# Altium schematic sheet L6790A_Si.SchDoc: LG L6790A Single Stage PFC LLC
size 594 x 420 mm; Author: Frank KWON; CompanyName: STMicroelectronics; DrawnBy: Frank KWON; Engineer: Frank KWON; Organization: AM&S APeC Korea; SheetNumber: 2; SheetTotal: 2
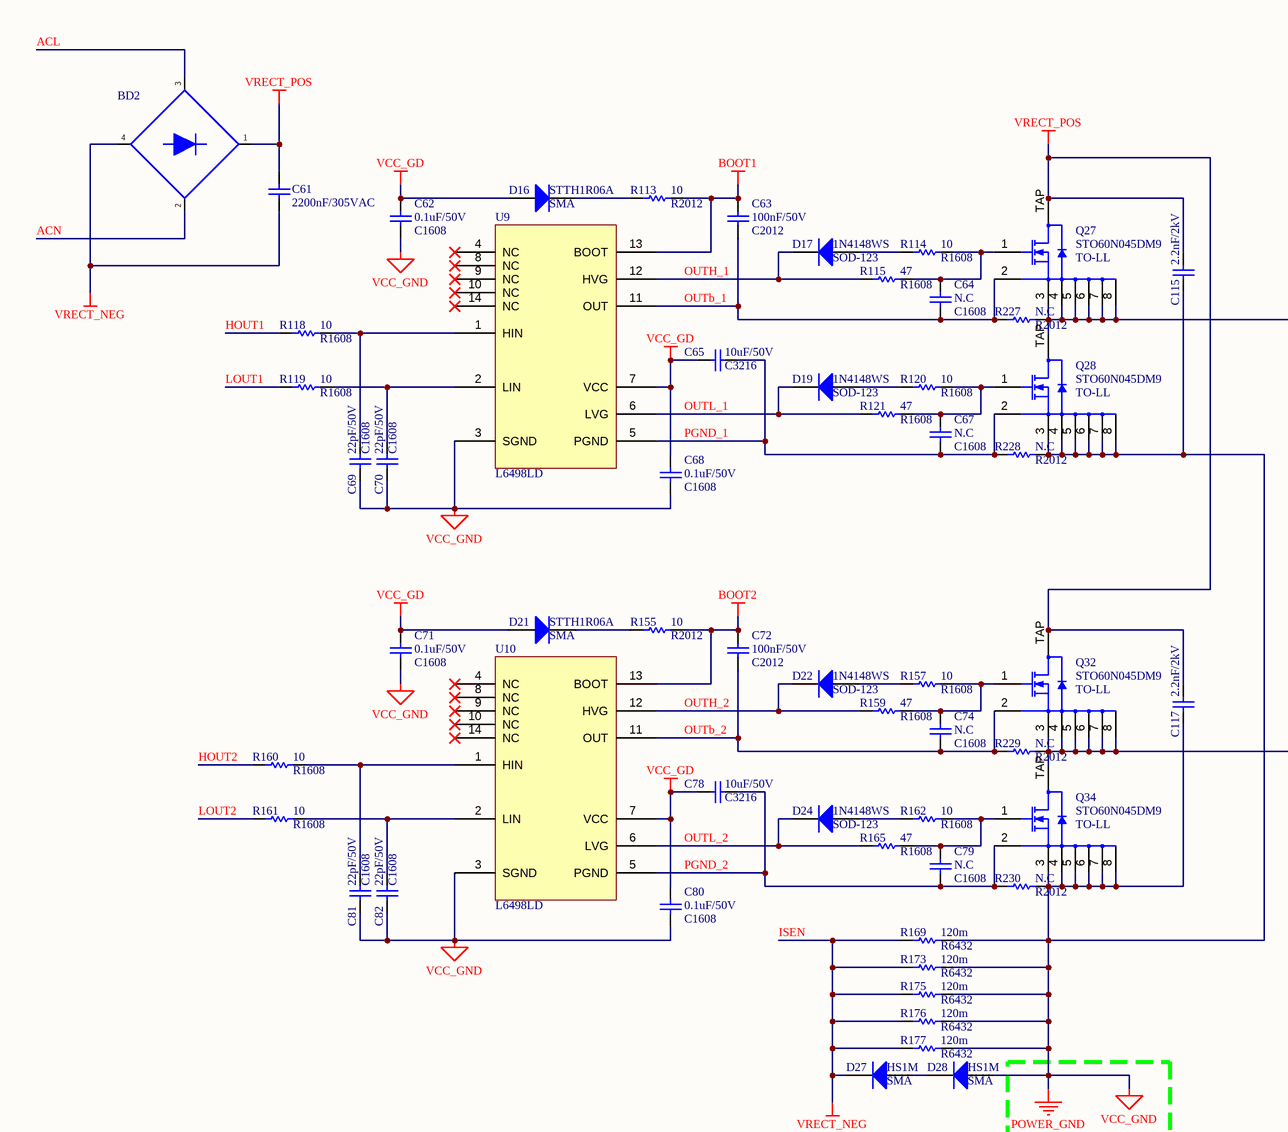
[diagram p0: L6790A_Si.SchDoc, top left]
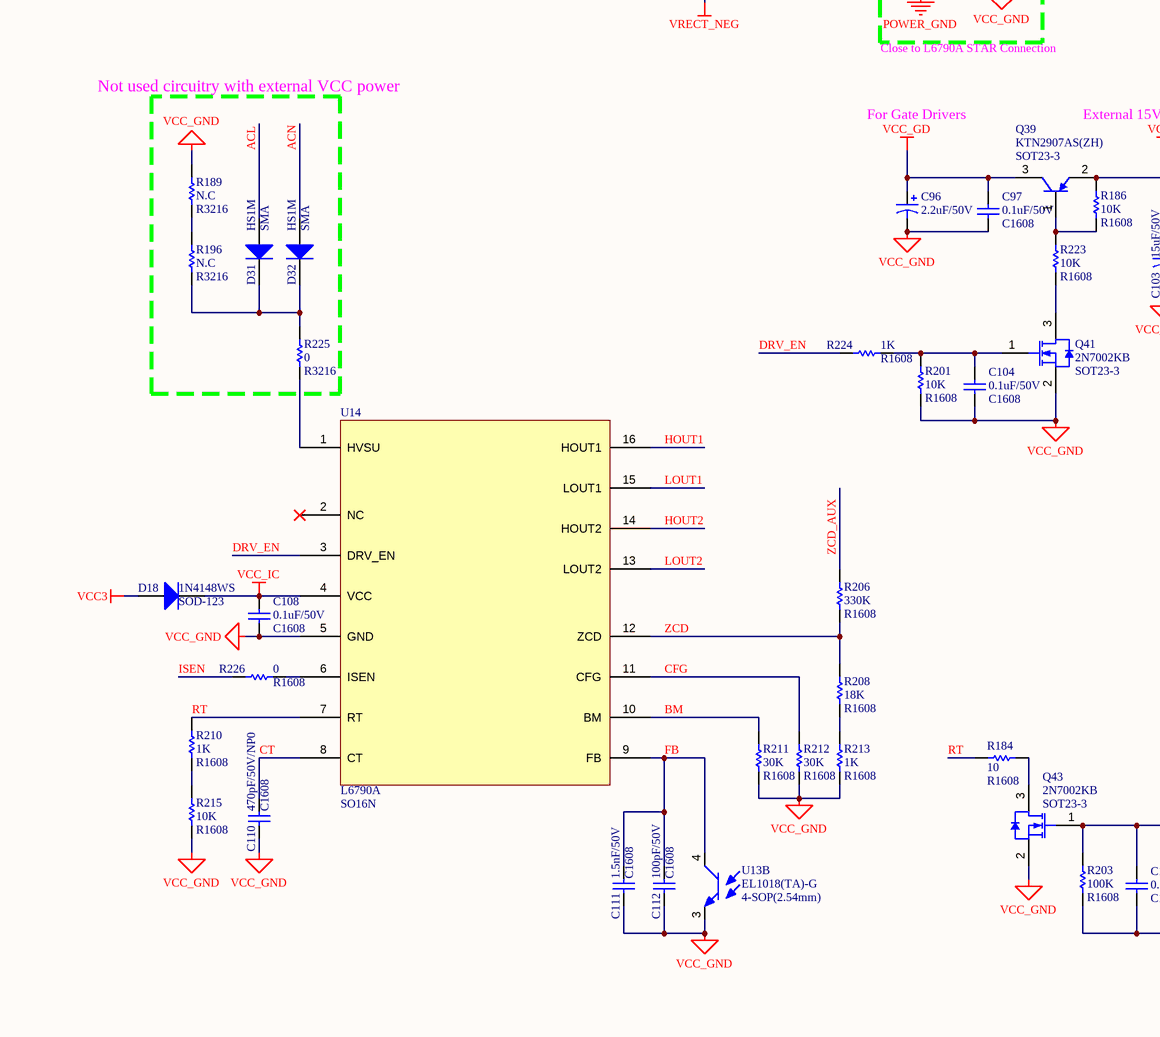
[diagram p1: L6790A_Si.SchDoc, bottom left]
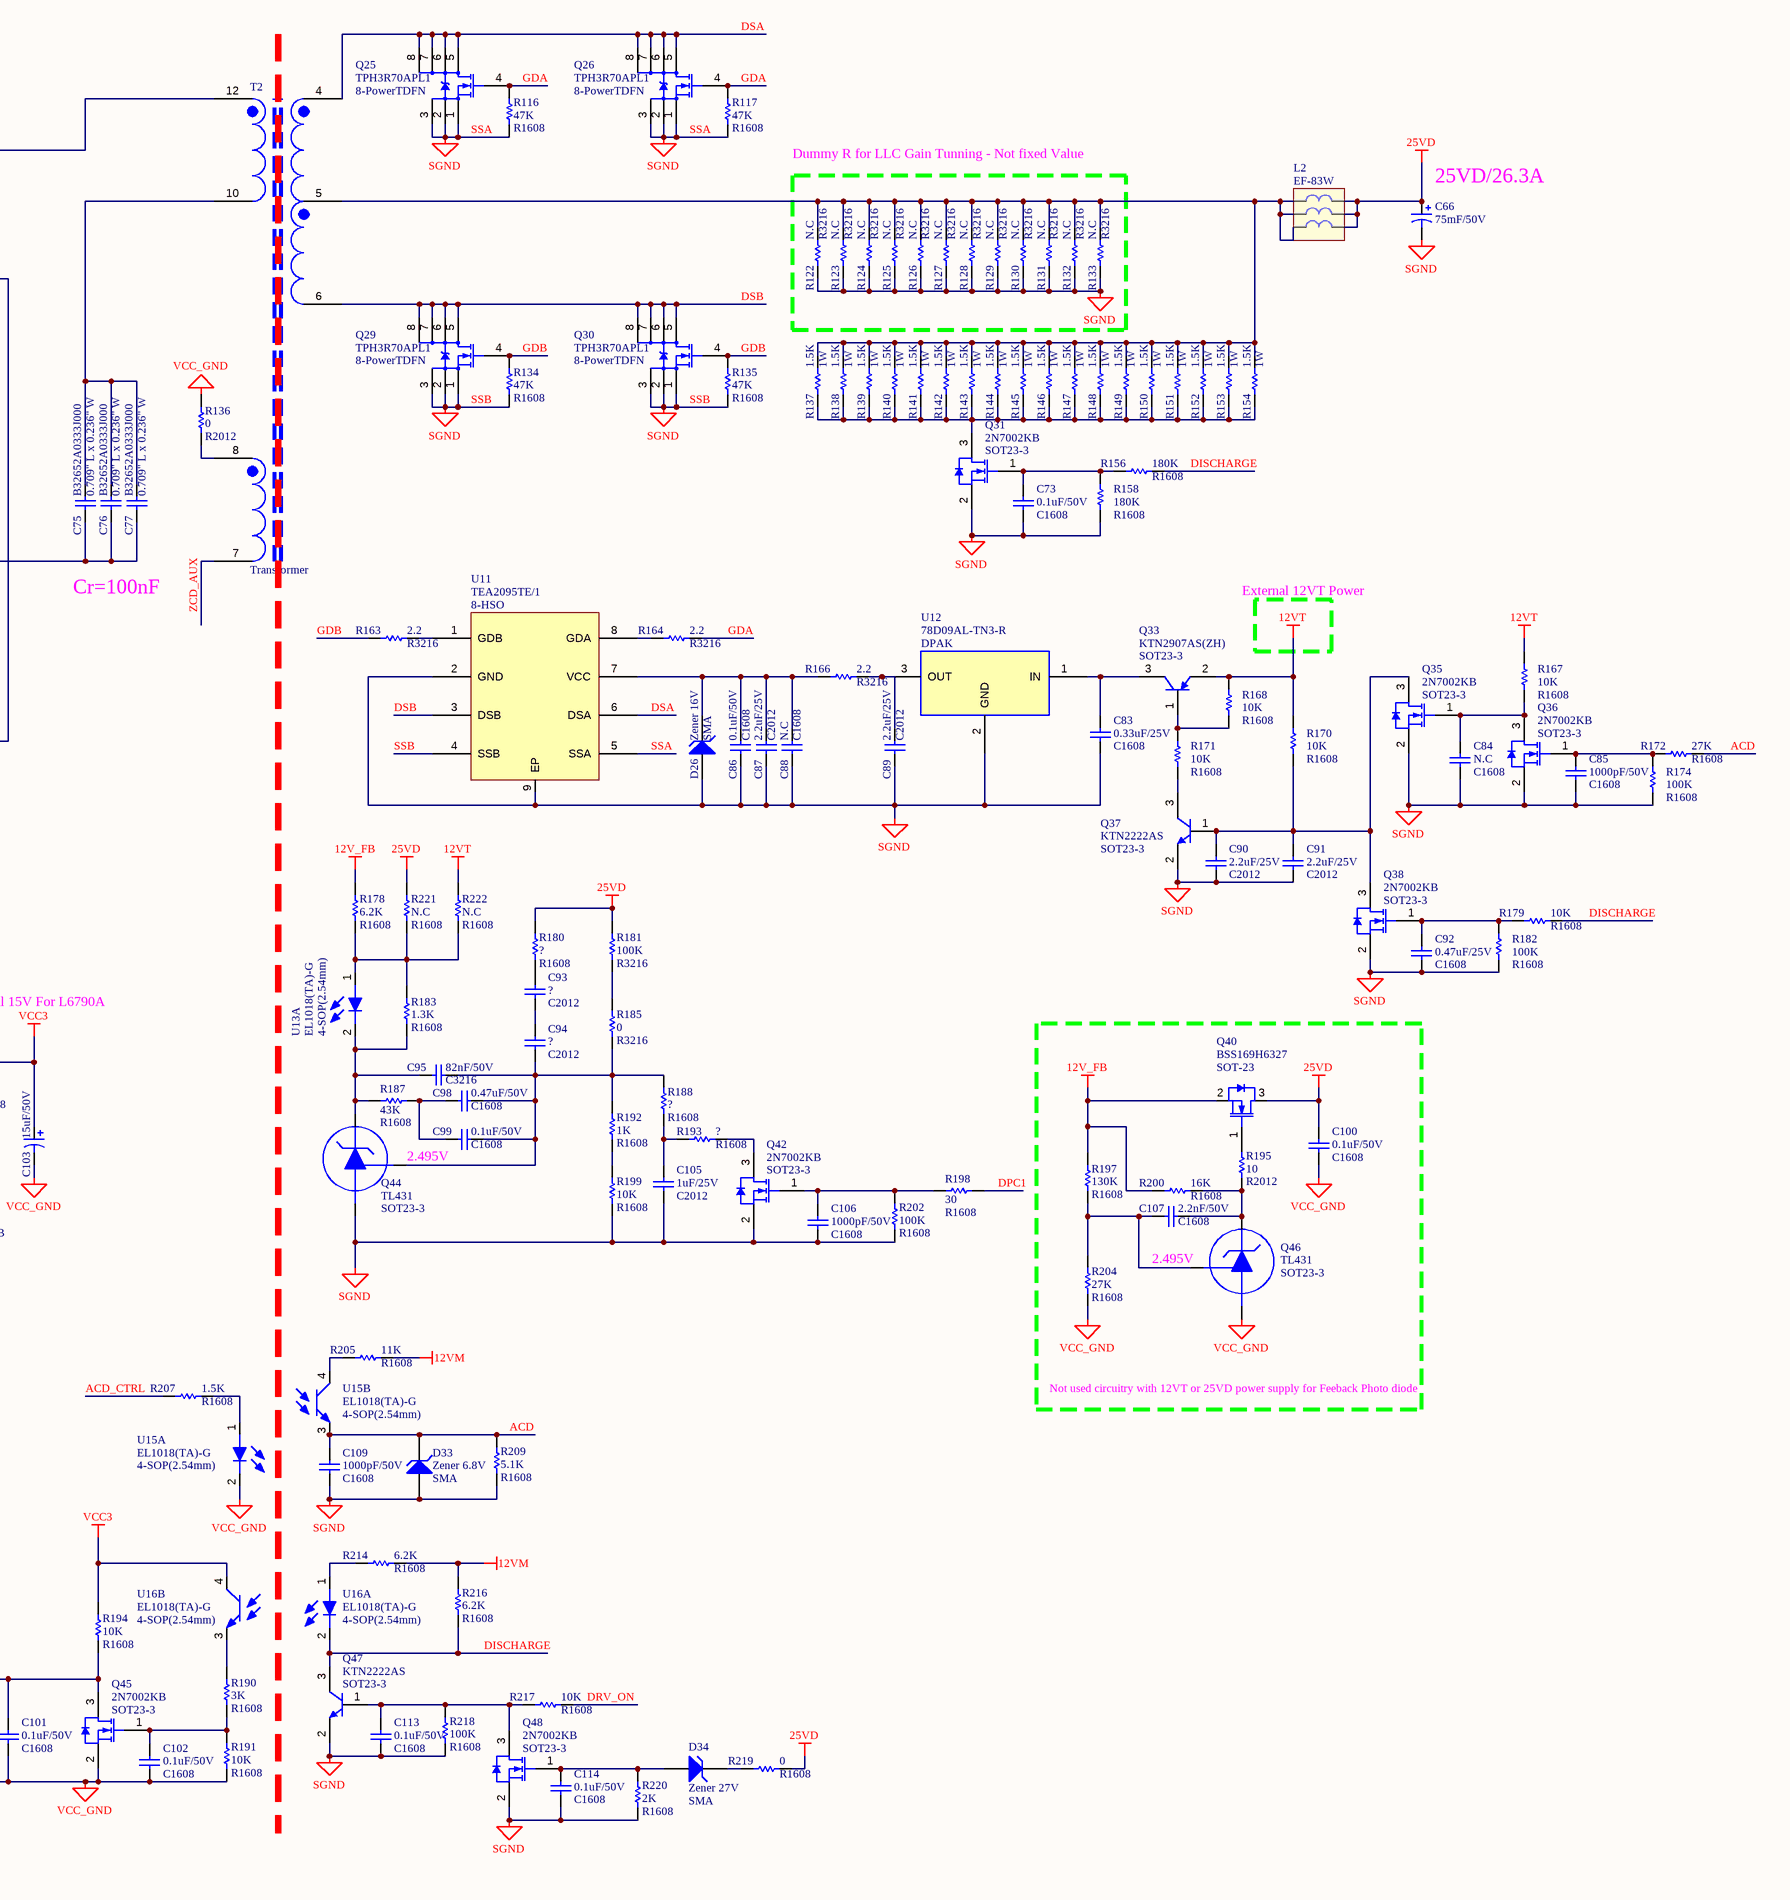
[diagram p2: L6790A_Si.SchDoc, bottom right]

## Parts
BD2  TS6KL60  [2W-DIO-MI-4L-4_6X25X15-7_5P-BD]  (value not drawn)
C61  2200nF/305VAC
C62  0.1uF/50V  Package/Case: C1608
C63  100nF/50V  Package/Case: C2012
C64  N.C  Package/Case: C1608
C65  10uF/50V  Package/Case: C3216
C66  75mF/50V  [1W-CAP-MI-2L-16DX25-7_5P-EL-F-R1212]
C67  N.C  Package/Case: C1608
C68  0.1uF/50V  Package/Case: C1608
C69  22pF/50V  Package/Case: C1608
C70  22pF/50V  Package/Case: C1608
C71  0.1uF/50V  Package/Case: C1608
C72  100nF/50V  Package/Case: C2012
C73  0.1uF/50V  Package/Case: C1608
C74  N.C  Package/Case: C1608
C75  B32652A0333J000  Package/Case: 0.709" L x 0.236" W
C76  B32652A0333J000  Package/Case: 0.709" L x 0.236" W
C77  B32652A0333J000  Package/Case: 0.709" L x 0.236" W
C78  10uF/50V  Package/Case: C3216
C79  N.C  Package/Case: C1608
C80  0.1uF/50V  Package/Case: C1608
C81  22pF/50V  Package/Case: C1608
C82  22pF/50V  Package/Case: C1608
C83  0.33uF/25V  Package/Case: C1608
C84  N.C  Package/Case: C1608
C85  1000pF/50V  Package/Case: C1608
C86  0.1uF/50V  Package/Case: C1608
C87  2.2uF/25V  Package/Case: C2012
C88  N.C  Package/Case: C1608
C89  2.2uF/25V  Package/Case: C2012
C90  2.2uF/25V  Package/Case: C2012
C91  2.2uF/25V  Package/Case: C2012
C92  0.47uF/25V  Package/Case: C1608
C93  ?  Package/Case: C2012
C94  ?  Package/Case: C2012
C95  82nF/50V  Package/Case: C3216  [CAP-CHP-3216-R0]
C96  2.2uF/50V  [CAP-RA-D5.0H12_5-P2-R0CA]
C97  0.1uF/50V  Package/Case: C1608
C98  0.47uF/50V  Package/Case: C1608
C99  0.1uF/50V  Package/Case: C1608
C100  0.1uF/50V  Package/Case: C1608
C101  0.1uF/50V  Package/Case: C1608
C102  0.1uF/50V  Package/Case: C1608
C103  15uF/50V  [CAP-RA-D5.0H12_5-P2-R0CA]
C104  0.1uF/50V  Package/Case: C1608
C105  1uF/25V  Package/Case: C2012
C106  1000pF/50V  Package/Case: C1608
C107  2.2nF/50V  Package/Case: C1608
C108  0.1uF/50V  Package/Case: C1608
C109  1000pF/50V  Package/Case: C1608
C110  470pF/50V/NP0  Package/Case: C1608
C111  1.5nF/50V  Package/Case: C1608
C112  100pF/50V  Package/Case: C1608
C113  0.1uF/50V  Package/Case: C1608
C114  0.1uF/50V  Package/Case: C1608
C115  2.2nF/2kV
C117  2.2nF/2kV
D16  STTH1R06A  Package/Case: SMA  [DIO-SOD123]
D17  1N4148WS  Package/Case: SOD-123  [DIO-SOD123]
D18  1N4148WS  Package/Case: SOD-123  [DIO-SOD123]
D19  1N4148WS  Package/Case: SOD-123  [DIO-SOD123]
D21  STTH1R06A  Package/Case: SMA  [DIO-SOD123]
D22  1N4148WS  Package/Case: SOD-123  [DIO-SOD123]
D24  1N4148WS  Package/Case: SOD-123  [DIO-SOD123]
D26  Zener 16V  Package/Case: SMA  [1W-DIO-CHP-2L-SOD106-SMA]
D27  HS1M  Package/Case: SMA  [DIO-SOD123]
D28  HS1M  Package/Case: SMA  [DIO-SOD123]
D31  HS1M  Package/Case: SMA  [DIO-SOD123]
D32  HS1M  Package/Case: SMA  [DIO-SOD123]
D33  Zener 6.8V  Package/Case: SMA  [1W-DIO-CHP-2L-SOD106-SMA]
D34  Zener 27V  Package/Case: SMA  [1W-DIO-CHP-2L-SOD106-SMA]
L2  EF-83W
Q25  TPH3R70APL1  Package/Case: 8-PowerTDFN
Q26  TPH3R70APL1  Package/Case: 8-PowerTDFN
Q27  STO60N045DM9  Package/Case: TO-LL
Q28  STO60N045DM9  Package/Case: TO-LL
Q29  TPH3R70APL1  Package/Case: 8-PowerTDFN
Q30  TPH3R70APL1  Package/Case: 8-PowerTDFN
Q31  2N7002KB  Package/Case: SOT23-3
Q32  STO60N045DM9  Package/Case: TO-LL
Q33  KTN2907AS(ZH)  Package/Case: SOT23-3
Q34  STO60N045DM9  Package/Case: TO-LL
Q35  2N7002KB  Package/Case: SOT23-3
Q36  2N7002KB  Package/Case: SOT23-3
Q37  KTN2222AS  Package/Case: SOT23-3
Q38  2N7002KB  Package/Case: SOT23-3
Q39  KTN2907AS(ZH)  Package/Case: SOT23-3
Q40  BSS169H6327  Package/Case: SOT-23  [SOT-23_TR]
Q41  2N7002KB  Package/Case: SOT23-3
Q42  2N7002KB  Package/Case: SOT23-3
Q43  2N7002KB  Package/Case: SOT23-3
Q44  TL431  Package/Case: SOT23-3  [SOT-23_TR]
Q45  2N7002KB  Package/Case: SOT23-3
Q46  TL431  Package/Case: SOT23-3  [SOT-23_TR]
Q47  KTN2222AS  Package/Case: SOT23-3
Q48  2N7002KB  Package/Case: SOT23-3
R113  10  Package/Case: R2012  [RES-1608]
R114  10  Package/Case: R1608  [RES-1608]
R115  47  Package/Case: R1608  [RES-1608]
R116  47K  Package/Case: R1608  [RES-1608]
R117  47K  Package/Case: R1608  [RES-1608]
R118  10  Package/Case: R1608  [RES-1608]
R119  10  Package/Case: R1608  [RES-1608]
R120  10  Package/Case: R1608  [RES-1608]
R121  47  Package/Case: R1608  [RES-1608]
R122  N.C  Package/Case: R3216  [RES-3216]
R123  N.C  Package/Case: R3216  [RES-3216]
R124  N.C  Package/Case: R3216  [RES-3216]
R125  N.C  Package/Case: R3216  [RES-3216]
R126  N.C  Package/Case: R3216  [RES-3216]
R127  N.C  Package/Case: R3216  [RES-3216]
R128  N.C  Package/Case: R3216  [RES-3216]
R129  N.C  Package/Case: R3216  [RES-3216]
R130  N.C  Package/Case: R3216  [RES-3216]
R131  N.C  Package/Case: R3216  [RES-3216]
R132  N.C  Package/Case: R3216  [RES-3216]
R133  N.C  Package/Case: R3216  [RES-3216]
R134  47K  Package/Case: R1608  [RES-1608]
R135  47K  Package/Case: R1608  [RES-1608]
R136  0  Package/Case: R2012  [RES-1608]
R137  1.5K  Package/Case: 1W
R138  1.5K  Package/Case: 1W
R139  1.5K  Package/Case: 1W
R140  1.5K  Package/Case: 1W
R141  1.5K  Package/Case: 1W
R142  1.5K  Package/Case: 1W
R143  1.5K  Package/Case: 1W
R144  1.5K  Package/Case: 1W
R145  1.5K  Package/Case: 1W
R146  1.5K  Package/Case: 1W
R147  1.5K  Package/Case: 1W
R148  1.5K  Package/Case: 1W
R149  1.5K  Package/Case: 1W
R150  1.5K  Package/Case: 1W
R151  1.5K  Package/Case: 1W
R152  1.5K  Package/Case: 1W
R153  1.5K  Package/Case: 1W
R154  1.5K  Package/Case: 1W
R155  10  Package/Case: R2012  [RES-1608]
R156  180K  Package/Case: R1608  [RES-1608]
R157  10  Package/Case: R1608  [RES-1608]
R158  180K  Package/Case: R1608  [RES-1608]
R159  47  Package/Case: R1608  [RES-1608]
R160  10  Package/Case: R1608  [RES-1608]
R161  10  Package/Case: R1608  [RES-1608]
R162  10  Package/Case: R1608  [RES-1608]
R163  2.2  Package/Case: R3216  [RES-3216]
R164  2.2  Package/Case: R3216  [RES-3216]
R165  47  Package/Case: R1608  [RES-1608]
R166  2.2  Package/Case: R3216  [RES-3216]
R167  10K  Package/Case: R1608  [RES-1608]
R168  10K  Package/Case: R1608  [RES-1608]
R169  120m  Package/Case: R6432
R170  10K  Package/Case: R1608  [RES-1608]
R171  10K  Package/Case: R1608  [RES-1608]
R172  27K  Package/Case: R1608  [RES-1608]
R173  120m  Package/Case: R6432
R174  100K  Package/Case: R1608  [RES-1608]
R175  120m  Package/Case: R6432
R176  120m  Package/Case: R6432
R177  120m  Package/Case: R6432
R178  6.2K  Package/Case: R1608  [RES-3216]
R179  10K  Package/Case: R1608  [RES-1608]
R180  ?  Package/Case: R1608  [RES-1608]
R181  100K  Package/Case: R3216  [RES-3216]
R182  100K  Package/Case: R1608  [RES-1608]
R183  1.3K  Package/Case: R1608  [RES-1608]
R184  10  Package/Case: R1608  [RES-1608]
R185  0  Package/Case: R3216  [RES-3216]
R186  10K  Package/Case: R1608  [RES-1608]
R187  43K  Package/Case: R1608  [RES-1608]
R188  ?  Package/Case: R1608  [RES-1608]
R189  N.C  Package/Case: R3216  [RES-3216]
R190  3K  Package/Case: R1608  [RES-1608]
R191  10K  Package/Case: R1608  [RES-1608]
R192  1K  Package/Case: R1608  [RES-1608]
R193  ?  Package/Case: R1608  [RES-1608]
R194  10K  Package/Case: R1608  [RES-1608]
R195  10  Package/Case: R2012  [RES-1608]
R196  N.C  Package/Case: R3216  [RES-3216]
R197  130K  Package/Case: R1608  [RES-1608]
R198  30  Package/Case: R1608  [RES-1608]
R199  10K  Package/Case: R1608  [RES-1608]
R200  16K  Package/Case: R1608  [RES-1608]
R201  10K  Package/Case: R1608  [RES-1608]
R202  100K  Package/Case: R1608  [RES-1608]
R203  100K  Package/Case: R1608  [RES-1608]
R204  27K  Package/Case: R1608  [RES-1608]
R205  11K  Package/Case: R1608  [RES-1608]
R206  330K  Package/Case: R1608  [RES-1608]
R207  1.5K  Package/Case: R1608  [RES-1608]
R208  18K  Package/Case: R1608  [RES-1608]
R209  5.1K  Package/Case: R1608  [RES-1608]
R210  1K  Package/Case: R1608  [RES-1608]
R211  30K  Package/Case: R1608  [RES-1608]
R212  30K  Package/Case: R1608  [RES-1608]
R213  1K  Package/Case: R1608  [RES-1608]
R214  6.2K  Package/Case: R1608  [RES-1608]
R215  10K  Package/Case: R1608  [RES-1608]
R216  6.2K  Package/Case: R1608  [RES-1608]
R217  10K  Package/Case: R1608  [RES-1608]
R218  100K  Package/Case: R1608  [RES-1608]
R219  0  Package/Case: R1608  [RES-1608]
R220  2K  Package/Case: R1608  [RES-1608]
R221  N.C  Package/Case: R1608  [RES-3216]
R222  N.C  Package/Case: R1608  [RES-3216]
R223  10K  Package/Case: R1608  [RES-1608]
R224  1K  Package/Case: R1608  [RES-1608]
R225  0  Package/Case: R3216  [RES-1608]
R226  0  Package/Case: R1608  [RES-1608]
R227  N.C  Package/Case: R2012  [RES-1608]
R228  N.C  Package/Case: R2012  [RES-1608]
R229  N.C  Package/Case: R2012  [RES-1608]
R230  N.C  Package/Case: R2012  [RES-1608]
T2  Transformer
U9  L6498LD
U10  L6498LD
U11  TEA2095TE/1  Package/Case: 8-HSO
U12  78D09AL-TN3-R  Package/Case: DPAK
U13  EL1018(TA)-G  Package/Case: 4-SOP(2.54mm)  [1W-IC-CHP-4L-3_6X7_6-2_54P-L10_2-PC]  (parts A,B of 2)
U14  L6790A  Package/Case: SO16N
U15  EL1018(TA)-G  Package/Case: 4-SOP(2.54mm)  [1W-IC-CHP-4L-3_6X7_6-2_54P-L10_2-PC]  (parts A,B of 2)
U16  EL1018(TA)-G  Package/Case: 4-SOP(2.54mm)  [1W-IC-CHP-4L-3_6X7_6-2_54P-L10_2-PC]  (parts A,B of 2)

## Blocks framed on the sheet
Dummy R for LLC Gain Tunning - Not fixed Value: R122-R133
2.495V: C100 C107 Q40 Q46 R195 R197 R200 R204

## Nets
12V_FB: Q40.2(SOURCE) R178.2 R197.1 R200.2
12VM: R205.2 R214.2 R216.2
12VT: Q33.2(E) R167.1 R168.1 R170.1 R222.2
25VD: C66.1 C100.1 L2.2 Q40.3(DRAIN) R180.2 R181.1 R219.2 R221.2
BOOT1: C63.1 R113.2 U9.13(BOOT)
BOOT2: C72.1 R155.2 U10.13(BOOT)
ISEN: BD2.4 C61.1 D27.2(K) R169.2 R173.2 R175.2 R176.2 R177.2 R226.1  [also labelled VRECT_NEG]
POWER_GND: C62.1 C68.2 C69.2 C70.2 C71.1 C80.2 C81.2 C82.2 C96.2 C97.2 C100.2 C101.2 C102.2 C103.2 C104.2 C108.2 C110.2 C111.2 C112.2 C115.2 C117.2 D28.1(A) Q28.3(PS) Q28.4(PS) Q28.5(PS) Q28.6(PS) Q28.7(PS) Q28.8(PS) Q34.3(PS) Q34.4(PS) Q34.5(PS) Q34.6(PS) Q34.7(PS) Q34.8(PS) Q41.2(S) Q43.2(S) Q45.2(S) Q46.3(A) R136.2 R169.1 R173.1 R175.1 R176.1 R177.1 R189.2 R191.2 R201.2 R203.2 R204.2 R211.2 R212.2 R213.2 R215.2 R228.2 R230.2 U9.3(SGND) U10.3(SGND) U13.3(E) U14.5(GND) U15.2(C)  [also labelled VCC_GND]
SSA: C66.2 C73.2 C83.2 C84.2 C85.2 C86.2 C87.2 C88.2 C89.2 C90.2 C91.2 C92.2 C105.2 C106.2 C109.2 C113.1 C114.1 D26.1(A) D33.1(A) Q25.1(S) Q25.2(S) Q25.3(S) Q26.1(S) Q26.2(S) Q26.3(S) Q29.1(S) Q29.2(S) Q29.3(S) Q30.1(S) Q30.2(S) Q30.3(S) Q31.2(S) Q35.2(S) Q36.2(S) Q37.2(E) Q38.2(S) Q42.2(S) Q44.3(A) Q47.2(E) Q48.2(S) R116.2 R117.2 R122.1 R123.1 R124.1 R125.1 R126.1 R127.1 R128.1 R129.1 R130.1 R131.1 R132.1 R133.1 R134.2 R135.2 R158.2 R174.2 R182.2 R199.2 R202.1 R209.1 R218.1 R220.1 U11.2(GND) U11.4(SSB) U11.5(SSA) U11.9(EP) U12.2(GND)  [also labelled SGND, SSB]
VCC3: C103.1 D18.1(A) Q39.2(E) R186.1 R194.1 U16.4(C)
VCC_GD: C62.2 C65.1 C68.1 C71.2 C78.1 C80.1 C96.1 C97.1 D16.1(A) D21.1(A) Q39.3(C) U9.7(VCC) U10.7(VCC)
VCC_IC: C108.1 D18.2(K) U14.4(VCC)
VRECT_POS: BD2.1 C61.2 C115.1 C117.1 Q27.TAP(D) Q32.TAP(D)
ACD: C109.1 D33.2(K) R172.2 R209.2 U15.3(E)
ACD_CTRL: R207.2
ACL: BD2.3 D31.1(A)
ACN: BD2.2 D32.1(A)
BM: R211.1 U14.10(BM)
CFG: R212.1 U14.11(CFG)
CT: C110.1 U14.8(CT)
DISCHARGE: Q47.3(C) R156.2 R179.2 R216.1 U16.2(C)
DPC1: R198.2
DRV_EN: R224.1 U14.3(DRV_EN)
DRV_ON: R217.2
DSA: Q25.5(D) Q25.6(D) Q25.7(D) Q25.8(D) Q26.5(D) Q26.6(D) Q26.7(D) Q26.8(D) T2.4 U11.6(DSA)
DSB: Q29.5(D) Q29.6(D) Q29.7(D) Q29.8(D) Q30.5(D) Q30.6(D) Q30.7(D) Q30.8(D) T2.6 U11.3(DSB)
FB: C111.1 C112.1 U13.4(C) U14.9(FB)
GDA: Q25.4(G) Q26.4(G) R116.1 R117.1 R164.1
GDB: Q29.4(G) Q30.4(G) R134.1 R135.1 R163.2
HOUT1: R118.1 U14.16(HOUT1)
HOUT2: R160.1 U14.14(HOUT2)
LOUT1: R119.1 U14.15(LOUT1)
LOUT2: R161.1 U14.13(LOUT2)
OUTb_1: C63.2 C64.2 Q27.2(DS) R227.1 U9.11(OUT)
OUTb_2: C72.2 C74.2 Q32.2(DS) R229.1 U10.11(OUT)
OUTH_1: D17.2(K) R115.2 U9.12(HVG)
OUTH_2: D22.2(K) R159.2 U10.12(HVG)
OUTL_1: D19.2(K) R121.2 U9.6(LVG)
OUTL_2: D24.2(K) R165.2 U10.6(LVG)
PGND_1: C65.2 C67.2 Q28.2(DS) R228.1 U9.5(PGND)
PGND_2: C78.2 C79.2 Q34.2(DS) R230.1 U10.5(PGND)
RT: R184.2 R210.1 U14.7(RT)
ZCD: R206.2 R208.1 U14.12(ZCD)
ZCD_AUX: R206.1 T2.7
NetC64_1: C64.1 Q27.1(G) R114.1 R115.1
NetC67_1: C67.1 Q28.1(G) R120.1 R121.1
NetC69_1: C69.1 R118.2 U9.1(HIN)
NetC70_1: C70.1 R119.2 U9.2(LIN)
NetC73_1: C73.1 Q31.1(G) R156.1 R158.1
NetC74_1: C74.1 Q32.1(G) R157.1 R159.1
NetC75_1: C75.1 C76.1 C77.1 T2.10
NetC75_2: C75.2 C76.2 C77.2 Q32.3(PS) Q32.4(PS) Q32.5(PS) Q32.6(PS) Q32.7(PS) Q32.8(PS) Q34.TAP(D) R229.2
NetC79_1: C79.1 Q34.1(G) R162.1 R165.1
NetC81_1: C81.1 R160.2 U10.1(HIN)
NetC82_1: C82.1 R161.2 U10.2(LIN)
NetC83_1: C83.1 Q33.3(C) U12.1(IN)
NetC84_1: C84.1 Q35.1(G) Q36.3(D) R167.2
NetC85_1: C85.1 Q36.1(G) R172.1 R174.1
NetC86_1: C86.1 C87.1 C88.1 D26.2(K) R166.2 U11.7(VCC)
NetC89_1: C89.1 R166.1 U12.3(OUT)
NetC90_1: C90.1 C91.1 Q35.3(D) Q37.1(B) Q38.3(D) R170.2
NetC92_1: C92.1 Q38.1(G) R179.1 R182.1
NetC93_1: C93.1 R180.1
NetC93_2: C93.2 C94.1
NetC94_2: C94.2 C95.1 C98.1 C99.1 Q44.1(R) R185.2 R188.2 R192.1
NetC95_2: C95.2 Q44.2(K) R183.2 R187.1 U13.2(C)
NetC98_2: C98.2 C99.2 R187.2
NetC101_1: C101.1 Q43.1(G) Q45.3(D) R194.2 R203.1
NetC102_1: C102.1 Q45.1(G) R190.2 R191.1
NetC104_1: C104.1 Q41.1(G) R201.1 R224.2
NetC105_1: C105.1 R188.1 R193.1
NetC106_1: C106.1 Q42.1(G) R198.1 R202.2
NetC107_1: C107.1 Q46.1(R) R197.2 R204.1
NetC107_2: C107.2 Q46.2(K) R195.2 R200.1
NetC113_2: C113.2 Q47.1(B) Q48.3(D) R217.1 R218.2
NetC114_2: C114.2 D34.1(A) Q48.1(G) R220.2
NetD16_2: D16.2(K) R113.1
NetD17_1: D17.1(A) R114.2
NetD19_1: D19.1(A) R120.2
NetD21_2: D21.2(K) R155.1
NetD22_1: D22.1(A) R157.2
NetD24_1: D24.1(A) R162.2
NetD27_1: D27.1(A) D28.2(K)
NetD31_2: D31.2(K) D32.2(K) R196.1 R225.2
NetD34_2: D34.2(K) R219.1
NetL2_1: L2.1 R122.2 R123.2 R124.2 R125.2 R126.2 R127.2 R128.2 R129.2 R130.2 R131.2 R132.2 R133.2 R137.2 R138.2 R139.2 R140.2 R141.2 R142.2 R143.2 R144.2 R145.2 R146.2 R147.2 R148.2 R149.2 R150.2 R151.2 R152.2 R153.2 R154.2 T2.5
NetQ27_3: Q27.3(PS) Q27.4(PS) Q27.5(PS) Q27.6(PS) Q27.7(PS) Q27.8(PS) Q28.TAP(D) R227.2 T2.12
NetQ31_3: Q31.3(D) R137.1 R138.1 R139.1 R140.1 R141.1 R142.1 R143.1 R144.1 R145.1 R146.1 R147.1 R148.1 R149.1 R150.1 R151.1 R152.1 R153.1 R154.1
NetQ33_1: Q33.1(B) R168.2 R171.1
NetQ37_3: Q37.3(C) R171.2
NetQ39_1: Q39.1(B) R186.2 R223.1
NetQ40_1: Q40.1(GATE) R195.1
NetQ41_3: Q41.3(D) R223.2
NetQ42_3: Q42.3(D) R193.2
NetQ43_3: Q43.3(D) R184.1
NetR136_1: R136.1 T2.8
NetR163_1: R163.1 U11.1(GDB)
NetR164_2: R164.2 U11.8(GDA)
NetR178_1: R178.1 R183.1 R221.1 R222.1 U13.1(A)
NetR181_2: R181.2 R185.1
NetR189_1: R189.1 R196.2
NetR190_1: R190.1 U16.3(E)
NetR192_2: R192.2 R199.1
NetR205_1: R205.1 U15.4(C)
NetR207_1: R207.1 U15.1(A)
NetR208_2: R208.2 R213.1
NetR210_2: R210.2 R215.1
NetR214_1: R214.1 U16.1(A)
NetR225_1: R225.1 U14.1(HVSU)
NetR226_2: R226.2 U14.6(ISEN)

Not connected (* = marked no-connect by the designer): U9 4(NC)* 8(NC)* 9(NC)* 10(NC)* 14(NC)*; U10 4(NC)* 8(NC)* 9(NC)* 10(NC)* 14(NC)*; U14 2(NC)*

## Notes on the sheet
- (near C66) 25VD/26.3A
- Cr=100nF
- External 12VT Power
- Close to L6790A STAR Connection
- Not used circuitry with external VCC power
- For Gate Drivers
- External 15V For L6790A
- 2.495V
- Not used circuitry with 12VT or 25VD power supply for Feeback Photo diode
- DWG NO:
- REV:
- THIS DOCUMENT AND THE DATA DISCLOSED HEREIN OR
- HEREWITH IS THE PROPERTY OF ALTIUM LIMITED AND MAY
- BE FREELY DISTRIBUTED IN WHOLE. NO RIGHTS ARE
- RESERVED OR EXPRESS OR IMPLIED WARANTEE GIVEN.
- REVISION
- DESCRIPTION
- DATE
- APPROVED
- ENG:
- APPROVALS
- PROJECT
- DSN:
- CHK:
- REFERENCE DOCUMENTS
- PROJECT REVISION:
- TITLE
- DOCUMENT REVISION:
- DESIGN ITEM:
- BOM:
- FAB DWG:
- PCB DWG:
- ASSY DWG:
- SCALE:
- A2
- SIZE
- CAGE CODE
- FILE NAME
- DWG NO.
- SHEET
- OF
- REV

## Library data of the parts
BD2 = BRIDGE: BRIDGE DIODE; Mount Type: DIP
C61-C65 C67-C95 C97-C102 C104-C115 C117 = Cap: Chip MLCC
  C61-C65 C67-C92 C97 C100-C102 C104 C106-C115 C117: Mounting Type: SMD
  C93-C95 C98 C99 C105: Mount Type: SMD
C66 = Cap Pol1: Electrolytic Capacitor; Mount Type: DIP
C96 C103 = Cap Pol1: Electrolytic Capacitor 33uF/25V; Mount Type: DIP
D16-D19 D21 D22 D24 D27 D28 D31 D32 = Diode 1N4148: DIODE SCHOTTKY 30V 200MA SOD123; Mount Type: SMD
D26 D33 D34 = D Zener: DIODE ZENER 30V 1W DO214AC; Mount Type: SMD
Q25 Q26 Q29 Q30 = TPH3R70APL1: N-Channel 100 V 90A (Tc) 210W (Tc) Surface Mount 8-SOP Advance (5x5.75); Mount Type: SMD
Q27 Q28 Q32 Q34 = STO60N045DM9: N‑channel 600 V, 35 mΩ typ., 56 A MDmesh DM9 Power MOSFET in a TO‑LL package; Mount Type: SMD
Q31 Q35 Q36 Q38 Q41-Q43 Q45 Q48 = 2N7002KB: N-CH MOSFET; Mounting Type: SMD
Q33 Q39 = ONSC-PNP-B1E2C3-3: PNP BJT; Mounting Type: SMD
Q37 Q47 = ONSC-NPN-B1E2C3-3: BJT NPN; Mounting Type: SMD
Q40 = CMP-32901-000982-1: MOSFET N-CH 100V 170MA SOT23-3; Mount Type: SMD
Q44 Q46 = 1W-IC-CHP-3L-SOT23-SCR-R0: IC VREF SHUNT ADJ 1% SOT23-3; Mount Type: SMD
R113-R136 R155-R230 = Res1: Chip Resistor; Mount Type: SMD
R137-R154 = Res1: Watt Resistor; Mount Type: SMD
U11 = TEA2095TE/1: LLC SR CONTROLLER IC; Mounting Type: SMD
U12 = 78D09AL-TN3-R: 3-TERMINALS 1A POSITIVE VOLTAGE REGULATOR; Mounting Type: SMD
U13 U15 U16 = SFH617A-2X019T: Photocoupler; Mount Type: SMD
U14 = L6790A: LLC-PFC controller IC for insulated power factor corrector application; Mounting Type: SMD
T2 = Transformer: Mount Type: DIP